# EAGLE design sdcard (EAGLE 7.1.0)
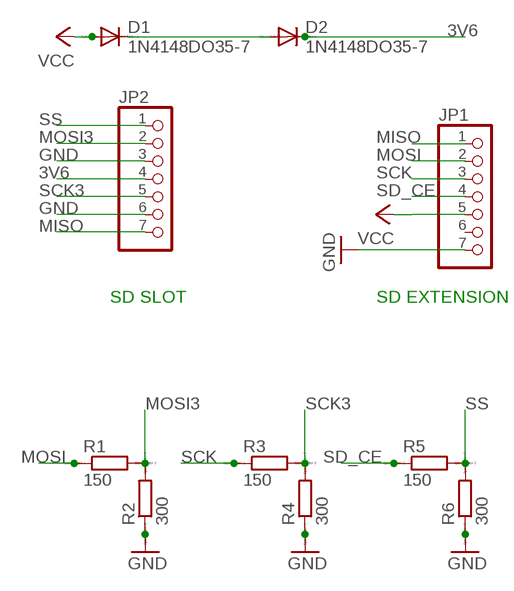
[diagram p0: schematic, sheet 1]

## Parts
D1  1N4148DO35-7  [DO35-7]
D2  1N4148DO35-7  [DO35-7]
JP1  PINHD-1X7  [1X07]
JP2  PINHD-1X7  [1X07]
R1  150  R-EU_R0805  [R0805]
R2  300  R-EU_R0805  [R0805]
R3  150  R-EU_R0805  [R0805]
R4  300  R-EU_R0805  [R0805]
R5  150  R-EU_R0805  [R0805]
R6  300  R-EU_R0805  [R0805]

## Nets
3V6: D2.C JP2.4
GND: JP1.7 JP2.3 JP2.6 R2.1 R4.1 R6.1
MISO: JP1.1 JP2.7
MOSI: JP1.2 R1.1
MOSI3: JP2.2 R1.2 R2.2
N$4: D1.C D2.A
SCK: JP1.3 R3.1
SCK3: JP2.5 R3.2 R4.2
SD_CE: JP1.4 R5.1
SS: JP2.1 R5.2 R6.2
VCC: D1.A JP1.5
Unconnected: JP1.6

## Notes on the sheet
- SD SLOT | SD EXTENSION

## Library data of the parts
D1 D2 = diode:1N4148: DIODE high speed (Philips)
JP1 JP2 = pinhead:PINHD-1X7: PIN HEADER
R1-R6 = resistor:R-EU_: RESISTOR, European symbol; SPICEPREFIX: R

## Board
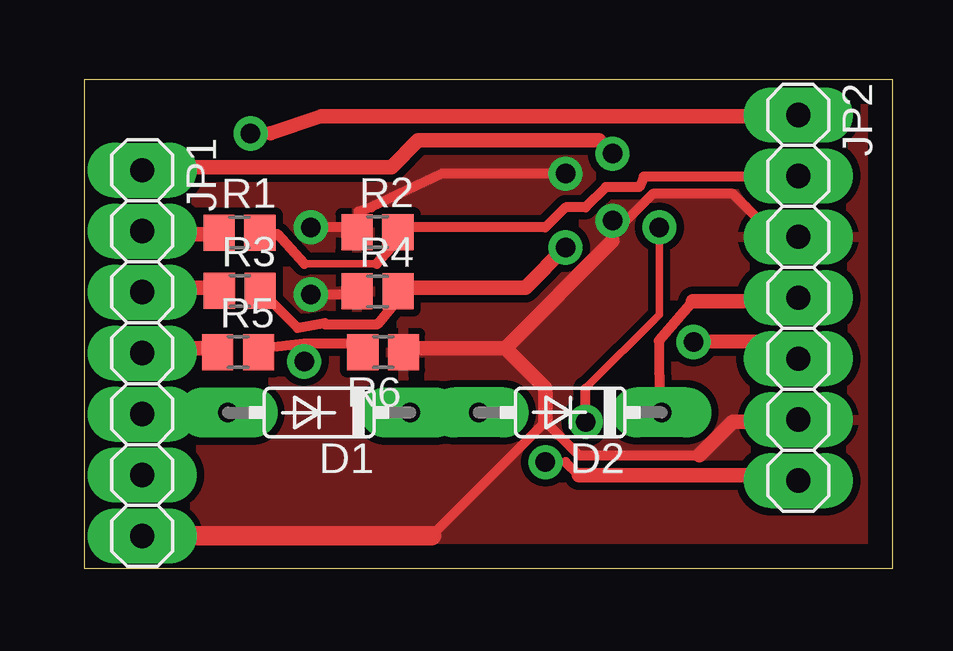
[diagram p1: board, top side]
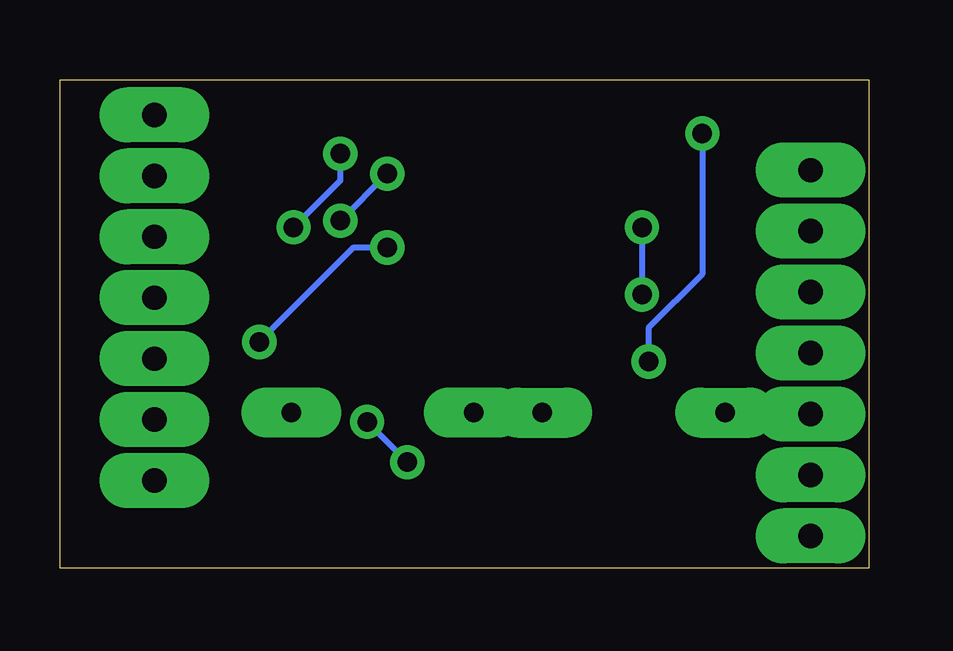
[diagram p2: board, bottom side, seen from below]

Size 33.71 x 20.34 mm. Coordinates in mm from the lower left corner, seen from the top.
Outline: 0,0 33.71,0 33.71,20.34 0,20.34 0,0
Copper layers (1*16): Top 0.035mm / dielectric 1.5mm / Bottom 0.035mm
Design rules "default *": minimum track width 10mil, minimum drill 32mil, track to track 12mil, track to pad 12mil, pad to pad 12mil, via to via 12mil, smd to smd 8mil, copper to edge 40mil, drill to drill 40mil, minimum pad ring 25mil, minimum via ring 12mil, stop-mask expansion 4mil, vias tented up to drill 0mil, thermal gap 10mil

### Footprints (pad centres in the part's own frame; a part is rotated, then mirrored left to right if it is on the bottom)
DO35-7 = drill 0.813 long: A 3.81,0; C -3.81,0
1X07 = drill 1.016 long: 1 -7.62,0; 2 -5.08,0; 3 -2.54,0; 4 0,0; 5 2.54,0; 6 5.08,0; 7 7.62,0
R0805 = smd 1.3 x 1.5: 1 -0.85,0; 2 0.85,0

### Placement (x,y rotation side)
D1  9.8,6.48 180 top
D2  20.26,6.48 180 top
JP1  2.42,8.96 270 top
JP2  29.77,11.26 270 top
R1  6.48,13.97 0 top
R2  12.23,14 0 top
R3  6.49,11.55 0 top
R4  12.23,11.53 0 top
R5  6.42,9 0 top
R6  12.47,9 180 top

### Tracks (layer width: path | path; a pad name or v marks a point on that pad's centre or on a via)
3V6
  Top 0.254: 23.98,6.65 D2.C | 29.57,11.12 JP2.4
  Top 0.406: 23.98,6.65 23.96,9.47 25.38,11.12
  Top 0.61: 29.57,11.12 25.38,11.12
GND  (via drill 0.81)
  Top 0.254: 11.43,14.85 11.41,14.2 R2.1 11.13,14.2 | 22.58,14.48 v22.03,14.48 22.03,13.64 | 28.73,13.92 29.57,13.92 JP2.3 | 11.13,11.4 R4.1 | 13.36,9.17 R6.1 | 2.47,1.34 JP1.7 | 29.57,6.09 JP2.6
  Top 0.406: 11.43,14.85 11.97,15.03 14.92,16.43 v20.07,16.43 | 22.58,14.48 23.7,15.59 27.05,15.59 28.73,13.92 | v9.45,11.4 11.13,11.4 | 11.13,14.2 v9.45,14.2 | 14.48,1.34 19.23,6.09 20.63,4.7 25.66,4.7
  Top 0.61: 17.55,9.17 13.36,9.17 | 22.03,13.64 17.55,9.17 | 19.23,6.09 19.23,7.49 17.55,9.17 | 29.57,6.09 27.05,6.09 25.66,4.7
  Top 0.813: 14.48,1.34 2.47,1.34
  Bottom 0.254: v22.03,14.48 v20.07,16.43 | v9.45,14.2 v9.45,11.4
  pour Top: 0.12,20.22 33.66,20.22 33.66,0.13 0.07,0.13 0.07,20.25
MISO  (via drill 0.81)
  Top 0.254: v22.03,17.27 21.47,17.83 | 20.07,4.42 v19.23,4.42 | 2.47,16.71 JP1.1 | 29.57,3.86 JP2.7
  Top 0.305: v23.98,14.2 23.98,10.56 20.91,7.49
  Top 0.406: v20.91,6.09 20.91,7.49 | 20.63,3.86 20.07,4.42
  Top 0.61: 2.47,16.71 12.8,16.71 13.92,17.83 21.47,17.83 | 29.57,3.86 20.63,3.86
  Bottom 0.254: v22.03,17.27 22.03,16.15 v23.98,14.2 | v19.23,4.42 v20.91,6.09
MOSI
  Top 0.254: 5.54,13.92 R1.1 | 2.47,13.92 JP1.2
  Top 0.61: 2.47,13.92 5.54,13.92
MOSI3
  Top 0.254: 8.06,13.92 7.5,13.92 R1.2 | 12.8,13.36 12.8,13.92 R2.2 13.08,14.2 | 29.47,16.31 JP2.2
  Top 0.305: 12.2,12.67 9.17,12.67
  Top 0.406: 9.17,12.67 8.06,13.92 | 12.8,13.36 12.2,12.67 | 13.08,14.2 19.23,14.2 20.07,15.03 20.91,15.03 21.75,15.87 23.14,15.87 23.33,16.31 29.47,16.31
N$4
  Top 0.254: D1.C 13.64,6.65 16.44,6.65 D2.A
SCK
  Top 0.254: 5.54,11.68 R3.1 | 2.47,11.68 JP1.3
  Top 0.61: 2.47,11.68 5.54,11.68
SCK3  (via drill 0.81)
  Top 0.254: 12.8,10.84 12.8,11.4 R4.2 13.08,11.68 | 10.03,10.22 10.01,10.17 | 7.5,11.4 R3.2 | 29.01,9.45 29.57,8.89 JP2.5
  Top 0.406: 12.8,10.84 12.25,10.17 10.01,10.17 | 10.03,10.22 8.89,10 7.5,11.4
  Top 0.61: 13.08,11.68 18.39,11.68 v20.07,13.36 | 29.01,9.45 v25.4,9.42
  Bottom 0.254: v20.07,13.36 21.47,13.36 v25.4,9.42
SD_CE
  Top 0.254: 5.54,9.17 R5.1 | 2.47,9.17 JP1.4
  Top 0.61: 2.47,9.17 5.54,9.17
SS  (via drill 0.81)
  Top 0.254: 7.5,9.17 R5.2 | 11.41,9.36 R6.2 | v9.17,8.61 9.17,9.36 | 7.78,18.11 v6.94,18.11 | 29.55,18.71 JP2.1
  Top 0.406: 11.41,9.36 9.17,9.36 7.5,9.17
  Top 0.61: 7.78,18.11 9.87,18.83 28.01,18.83 29.55,18.71
  Bottom 0.254: v9.17,8.61 9.17,10 6.94,12.24 v6.94,18.11
VCC
  Top 0.254: 5.82,6.65 D1.A | 2.47,6.65 JP1.5
  Top 0.61: 2.47,6.65 5.82,6.65